# EAGLE design GEP Main Board V1.0 (EAGLE 9.5.1)
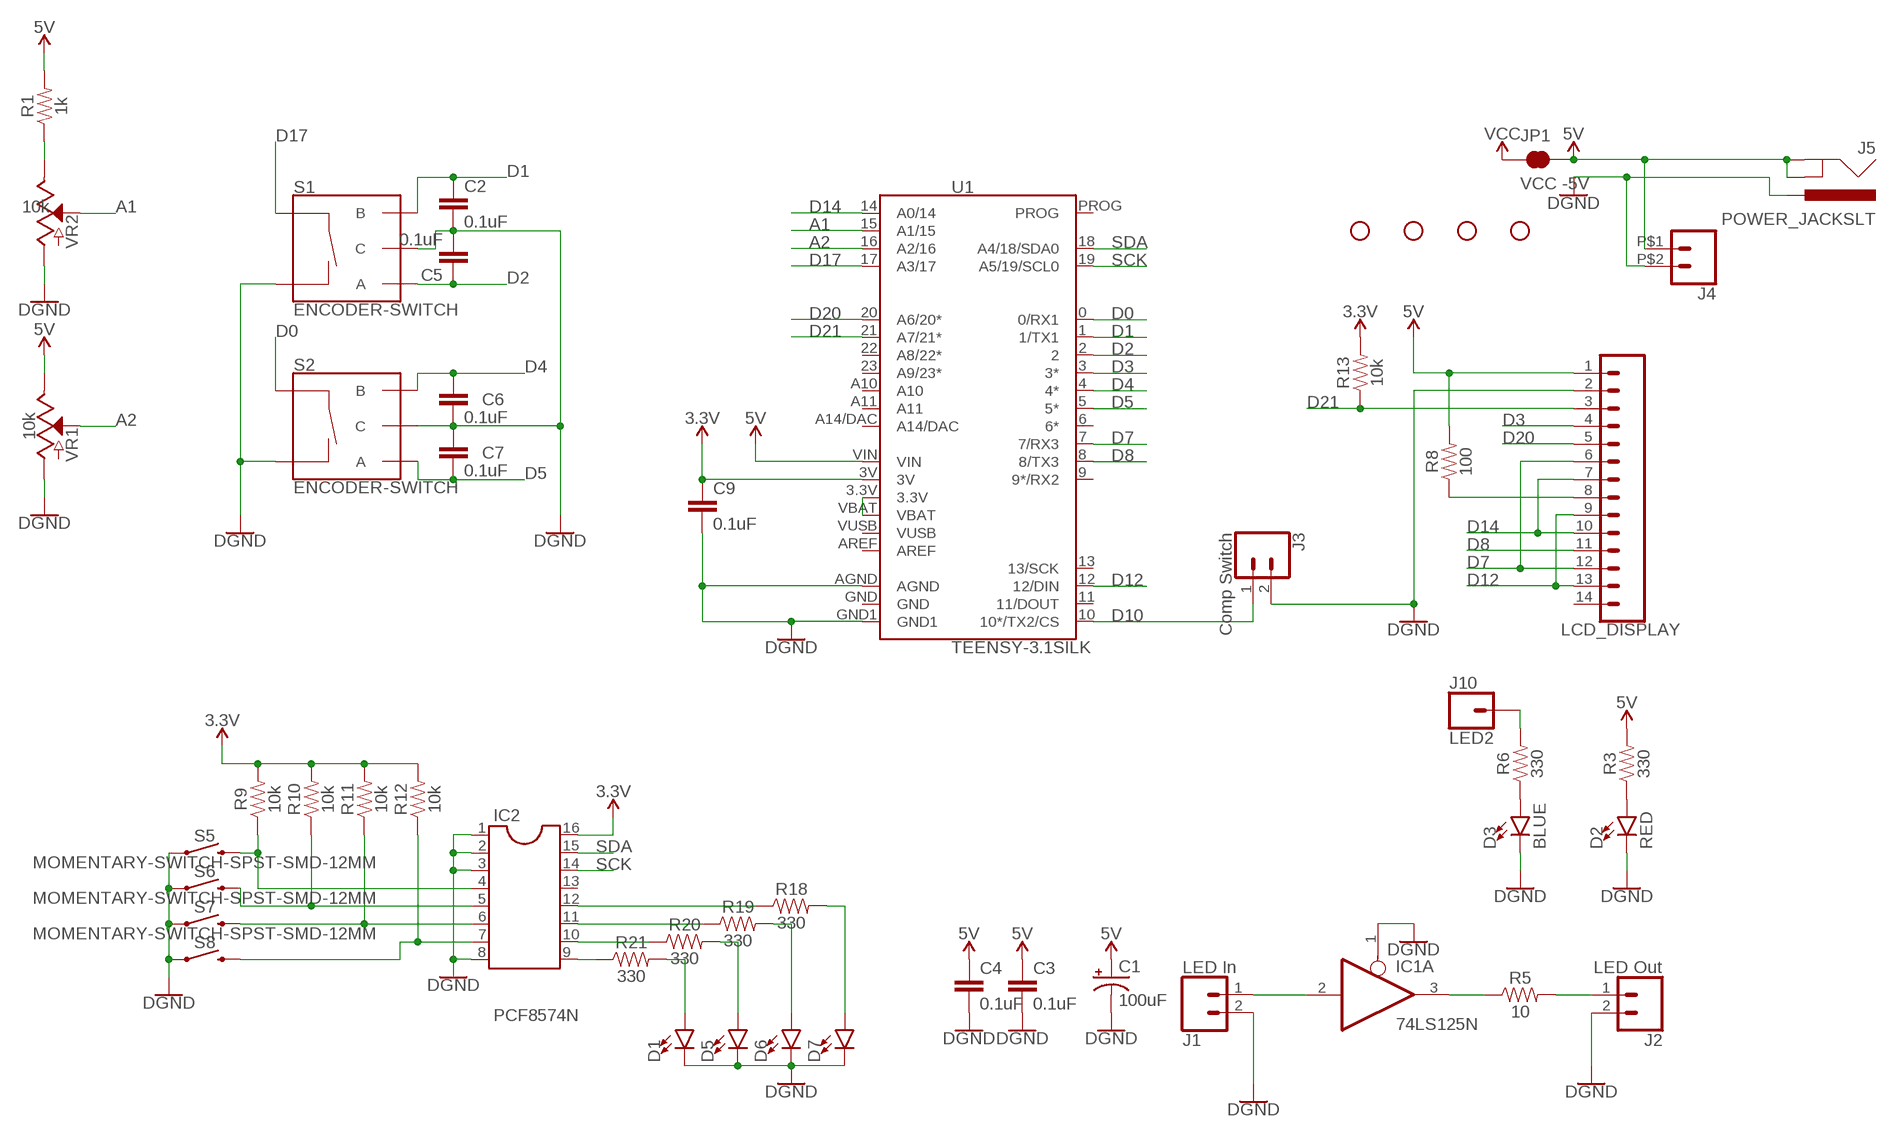
[diagram p0: schematic, sheet 1]

## Parts
C1  100uF  100UF-POLAR-RADIAL-2.5MM-25V-20%  [CPOL-RADIAL-2.5MM-6.5MM]
C2  0.1uF  0.1UF-KIT-EZ-50V-20%  [CAP-PTH-SMALL-KIT]
C3  0.1uF  0.1UF-KIT-EZ-50V-20%  [CAP-PTH-SMALL-KIT]
C4  0.1uF  0.1UF-KIT-EZ-50V-20%  [CAP-PTH-SMALL-KIT]
C5  0.1uF  0.1UF-KIT-EZ-50V-20%  [CAP-PTH-SMALL-KIT]
C6  0.1uF  0.1UF-KIT-EZ-50V-20%  [CAP-PTH-SMALL-KIT]
C7  0.1uF  0.1UF-KIT-EZ-50V-20%  [CAP-PTH-SMALL-KIT]
C9  0.1uF  0.1UF-KIT-EZ-50V-20%  [CAP-PTH-SMALL-KIT]
D1  LED5MM  [LED_5MM]
D2  RED  LED5MM  [LED_5MM]
D3  BLUE  LED5MM  [LED_5MM]
D5  LED5MM  [LED_5MM]
D6  LED5MM  [LED_5MM]
D7  LED5MM  [LED_5MM]
H1  STAND-OFF  [STAND-OFF]
H2  STAND-OFF  [STAND-OFF]
H3  STAND-OFF  [STAND-OFF]
H4  STAND-OFF  [STAND-OFF]
IC1  74LS125N  [DIL14]
IC2  PCF8574N  DIL16S  [SOCKET-16]
J1  LED In  CONN_02  [1X02]
J2  LED Out  CONN_02  [1X02]
J3  Comp Switch  CONN_02  [1X02]
J4  CONN_02PTH2  [1X02_BIG]
J5  POWER_JACKSLT  [POWER_JACK_SLOT]
J10  LED2  CONN_01  [1X01]
JP1  VCC -5V  JUMPER-SMT_2_NC_TRACE_SILK  [SMT-JUMPER_2_NC_TRACE_SILK]
LCDDISPLAY  LCD_DISPLAY  CONN_14  [1X14]
R1  1k  1KOHM-HORIZ-1/4W-1%  [AXIAL-0.3]
R3  330  330OHM-HORIZ-1/10W-5%  [AXIAL-0.3]
R5  10  10OHM-HORIZ-1/4W-1%  [AXIAL-0.3]
R6  330  330OHM-HORIZ-1/10W-5%  [AXIAL-0.3]
R8  100  10OHM-HORIZ-1/4W-1%  [AXIAL-0.3]
R9  10k  10KOHM-HORIZ-1/4W-5%  [AXIAL-0.3]
R10  10k  10KOHM-HORIZ-1/4W-5%  [AXIAL-0.3]
R11  10k  10KOHM-HORIZ-1/4W-5%  [AXIAL-0.3]
R12  10k  10KOHM-HORIZ-1/4W-5%  [AXIAL-0.3]
R13  10k  10KOHM-HORIZ-1/4W-1%  [AXIAL-0.3]
R18  330  330OHM-HORIZ-1/10W-5%  [AXIAL-0.3]
R19  330  330OHM-HORIZ-1/10W-5%  [AXIAL-0.3]
R20  330  330OHM-HORIZ-1/10W-5%  [AXIAL-0.3]
R21  330  330OHM-HORIZ-1/10W-5%  [AXIAL-0.3]
S1  ENCODER-SWITCH  [ROTARY_ENC_PLAIN]
S2  ENCODER-SWITCH  [ROTARY_ENC_PLAIN]
S5  MOMENTARY-SWITCH-SPST-SMD-12MM  [TACTILE_SWITCH_SMD_12MM]
S6  MOMENTARY-SWITCH-SPST-SMD-12MM  [TACTILE_SWITCH_SMD_12MM]
S7  MOMENTARY-SWITCH-SPST-SMD-12MM  [TACTILE_SWITCH_SMD_12MM]
S8  MOMENTARY-SWITCH-SPST-SMD-12MM  [TACTILE_SWITCH_SMD_12MM]
U1  TEENSY-3.1SILK  [TEENSY-3.1]
VR1  10k  POTENTIOMETER-PTH-9MM-1/20W-20%-KIT  [POT-PTH-ALPS-KIT]
VR2  10k  POTENTIOMETER-PTH-9MM-1/20W-20%-KIT  [POT-PTH-ALPS-KIT]

## Nets
3.3V: C9.1 IC2.16 R9.P$2 R10.P$2 R11.P$2 R12.P$2 R13.P$2 U1.3V
5V: C1.1(+) C3.1 C4.1 J4.P$1 J5.GND@1(GNDBREAK) J5.GND@2(GND) JP1.2 LCDDISPLAY.1 R1.P$2 R3.P$2 R8.P$2 U1.VIN VR1.P$1(E)
A1: U1.15(A1/15) VR2.P$2(S)
A2: U1.16(A2/16) VR1.P$2(S)
D0: S2.SW+ U1.0(0/RX1)
D1: C2.1 S1.B U1.1(1/TX1)
D2: C5.1 S1.A U1.2
D3: LCDDISPLAY.4 U1.3(3*)
D4: C6.1 S2.B U1.4(4*)
D5: C7.2 S2.A U1.5(5*)
D7: LCDDISPLAY.6 LCDDISPLAY.12 U1.7(7/RX3)
D8: LCDDISPLAY.11 U1.8(8/TX3)
D10: J3.1 U1.10(10*/TX2/CS)
D12: LCDDISPLAY.9 LCDDISPLAY.13 U1.12(12/DIN)
D14: LCDDISPLAY.7 LCDDISPLAY.10 U1.14(A0/14)
D17: S1.SW+ U1.17(A3/17)
D20: LCDDISPLAY.5 U1.20(A6/20*)
D21: LCDDISPLAY.3 R13.P$1 U1.21(A7/21*)
GND: C1.2(-) C2.2 C3.2 C4.2 C5.2 C6.2 C7.1 C9.2 D1.K(C) D2.K(C) D3.K(C) D5.K(C) D6.K(C) D7.K(C) IC1.1(A:OE) IC2.1 IC2.2 IC2.3 IC2.8 J1.2 J2.2 J3.2 J4.P$2 J5.PWR LCDDISPLAY.2 S1.C S1.SW- S2.C S2.SW- S5.1 S6.1 S7.1 S8.1 U1.AGND U1.GND1 VR1.P$3(A) VR2.P$3(A) ; supply symbol labelled DGND
LED: LCDDISPLAY.8 R8.P$1
N$1: U1.3.3V U1.VBAT
N$2: IC2.9 R21.P$1
N$3: IC2.10 R20.P$1
N$4: IC1.2(A:I) J1.1
N$5: IC1.3(A:O) R5.P$1
N$6: R1.P$1 VR2.P$1(E)
N$8: D3.A R6.P$1
N$9: D2.A R3.P$1
N$10: IC2.5 R10.P$1 S6.3
N$11: IC2.6 R11.P$1 S7.3
N$12: IC2.7 R12.P$1 S8.3
N$13: IC2.4 R9.P$1 S5.3
N$14: J2.1 R5.P$2
N$15: IC2.11 R19.P$1
N$16: IC2.12 R18.P$1
N$17: D1.A R21.P$2
N$18: D5.A R20.P$2
N$19: D6.A R19.P$2
N$20: D7.A R18.P$2
N$23: J10.1 R6.P$2
SCK: IC2.14 U1.19(A5/19/SCL0)
SDA: IC2.15 U1.18(A4/18/SDA0)
VCC: JP1.1
Unconnected: IC1.4(B:OE) IC1.5(B:I) IC1.6(B:O) IC1.8(C:O) IC1.9(C:I) IC1.10(C:OE) IC1.11(D:O) IC1.12(D:I) IC1.13(D:OE) IC2.13 LCDDISPLAY.14 U1.6(6*) U1.9(9*/RX2) U1.11(11/DOUT) U1.13(13/SCK) U1.22(A8/22*) U1.23(A9/23*) U1.A10 U1.A11 U1.A14/DAC U1.AREF U1.PROG

## Power pins joined to a net without a drawn wire
GND: IC1.7(P:GND) U1.GND
VCC: IC1.14(P:VCC)
VUSB: U1.VUSB

## Library data of the parts
C1 = SparkFun-Capacitors:100UF-POLAR: 100µF polarized capacitors A capacitor is a passive two-terminal electrical component used to store electrical energy temporarily in an electric field.; PROD_ID: CAP-08439
C2-C7 C9 = SparkFun-Capacitors:0.1UF: 0.1µF ceramic capacitors A capacitor is a passive two-terminal electrical component used to store electrical energy temporarily in an electric field.; PROD_ID: CAP-08370
D1-D3 D5-D7 = SparkFun-LED:LED: LED (Generic) Standard schematic elements and footprints for 5mm, 3mm, 1206, and 0603 sized LEDs. Generic LEDs with no color specified.
H1-H4 = SparkFun-Hardware:STAND-OFF: Stand Off Drill holes for mechanically mounting via screws, standoffs, etc. Note: Use the keepout ring to avoid running the screw head into surrounding components. Variant Overviews STAND-OFF - Mechanical footprint for a #4 phillips button head screw. STAND-OFF-TIGHT - Mechanical footprint for a #4 phillips button head screw, Example SparkFun Products Screw - Phillips Head (1/4", 4-40, 10 pack) <https://www.sparkfun.com/products/10453> (PRT-10453) Screw - Phillips Head (1/2", 4-40, 10 pack) <https://www.sparkfun.com/products/10452> (PRT-10452) Screw - Phillips Head (3/4", 4-40, 10 pack) <https://www.sparkfun.com/products/10451> (PRT-10451) Screw - Phillips Head (1", 4-40, 10 pack) <https://www.sparkfun.com/products/10450> (PRT-10450)
IC1 = 74xx-us:74*125: Quad bus BUFFER, 3-state
IC2 = ic-package:DIL16: Dual In Line / Socket
J1-J4 = SparkFun-Connectors:CONN_02: Multi connection point. Often used as Generic Header-pin footprint for 0.1 inch spaced/style header connections On any of the 0.1 inch spaced packages, you can populate with these: Break Away Headers - Straight <https://www.sparkfun.com/products/116> (PRT-00116) Break Away Male Headers - Right Angle <https://www.sparkfun.com/products/553> (PRT-00553) Female Headers <https://www.sparkfun.com/products/115> (PRT-00115) Break Away Headers - Machine Pin <https://www.sparkfun.com/products/117> (PRT-00117) Break Away Female Headers - Swiss Machine Pin <https://www.sparkfun.com/products/743> (PRT-00743) For SCREWTERMINALS and SPRING TERMINALS visit here: Screw Terimnals on SparkFun.com <https://www.sparkfun.com/search/results?term=Screw+Terminals> (5mm/3.5mm/2.54mm spacing) This device is also useful as a general connection point to wire up your design to another part of your project. Our various solder wires solder well into these plated through hole pads. Hook-Up Wire - Assortment (Stranded, 22 AWG) <https://www.sparkfun.com/products/11375> (PRT-11375) Hook-Up Wire - Assortment (Solid Core, 22 AWG) <https://www.sparkfun.com/products/11367> (PRT-11367) View the entire wire category on our website here <https://www.sparkfun.com/categories/141> Special notes: Molex polarized connector foot print use with: PRT-08233 with associated crimp pins and housings. 2.54_SCREWTERM for use with PRT-10571. 3.5mm Screw Terminal footprints for PRT-08084 5mm Screw Terminal footprints for use with PRT-08432
J5 = SparkFun-Connectors:POWER_JACK: Power Jack Connector This is the standard 5.5mm barrel jack for power. The PTH is the most common, proven, reliable, footprint. The Slot footprint only works if the mill layer is transmitted to the PCB fab house so be warned. Here are the connectors we sell at SparkFun: DC Barrel Power Jack/Connector <https://www.sparkfun.com/products/119> (PRT-00119) DC Barrel Power Jack/Connector (SMD) <https://www.sparkfun.com/products/12748> (PRT-12748) DC Barrel Jack Adapter - Breadboard Compatible <https://www.sparkfun.com/products/10811> (PRT-10811) It is used on this SparkFun product (and many, many others): SparkFun RedBoard - Programmed with Arduino <https://www.sparkfun.com/products/12757> (DEV-12757) Also, if you need a mating power supply or connector, please check these out: Wall Adapter Power Supply - 9VDC 650mA <https://www.sparkfun.com/products/298> (TOL-00298) DC Barrel Jack Adapter - Male <https://www.sparkfun.com/products/10287> (PRT-10287); PROD_ID: PRT-00119
J10 = SparkFun-Connectors:CONN_01: Single connection point. Often used as Generic Header-pin footprint for 0.1 inch spaced/style header connections On any of the 0.1 inch spaced packages, you can populate with these: Break Away Headers - Straight <https://www.sparkfun.com/products/116> (PRT-00116) Break Away Male Headers - Right Angle <https://www.sparkfun.com/products/553> (PRT-00553) Female Headers <https://www.sparkfun.com/products/115> (PRT-00115) Break Away Headers - Machine Pin <https://www.sparkfun.com/products/117> (PRT-00117) Break Away Female Headers - Swiss Machine Pin <https://www.sparkfun.com/products/743> (PRT-00743) This device is also useful as a general connection point to wire up your design to another part of your project. Our various solder wires solder well into these plated through hole pads. Hook-Up Wire - Assortment (Stranded, 22 AWG) <https://www.sparkfun.com/products/11375> (PRT-11375) Hook-Up Wire - Assortment (Solid Core, 22 AWG) <https://www.sparkfun.com/products/11367> (PRT-11367) View the entire wire category on our website here <https://www.sparkfun.com/categories/141> Special notes: SMTSO-256-ET is a "flush mount" nut for a 4-40 screw. We mostly use this on specialty testbeds; it is a nice way to connect hardware to your PCB at an adjustable hieght. Also note, the SNAP packages are for using a snappable style connector. We sell a baggie of snaps and they are also used on two LilyPad designs: Snap Assortment - 30 pack (male and female) <https://www.sparkfun.com/products/11347> (DEV-11347) LilyPad Arduino SimpleSnap <https://www.sparkfun.com/products/10941> (DEV-10941) LilyPad SimpleSnap Protoboard <https://www.sparkfun.com/products/10940> (DEV-10940)
JP1 = SparkFun-Jumpers:JUMPER-SMT_2_NC_TRACE: Normally closed trace jumper This jumper has a trace between two pads so it's normally closed (NC). Use a razor knife to open the connection. For best results follow the IPC guidelines for cutting traces: Cutout at least 0.063 mm (0.005 in). Remove all loose material to clean up the cut area. Seal the cut with an approved epoxy. Reapply solder to reclose the connection.
LCDDISPLAY = SparkFun-Connectors:CONN_14: Multi connection point. Often used as Generic Header-pin footprint for 0.1 inch spaced/style header connections On any of the 0.1 inch spaced packages, you can populate with these: Break Away Headers - Straight <https://www.sparkfun.com/products/116> (PRT-00116) Break Away Male Headers - Right Angle <https://www.sparkfun.com/products/553> (PRT-00553) Female Headers <https://www.sparkfun.com/products/115> (PRT-00115) Break Away Headers - Machine Pin <https://www.sparkfun.com/products/117> (PRT-00117) Break Away Female Headers - Swiss Machine Pin <https://www.sparkfun.com/products/743> (PRT-00743) For SCREWTERMINALS and SPRING TERMINALS visit here: Screw Terimnals on SparkFun.com <https://www.sparkfun.com/search/results?term=Screw+Terminals> (5mm/3.5mm/2.54mm spacing) This device is also useful as a general connection point to wire up your design to another part of your project. Our various solder wires solder well into these plated through hole pads. Hook-Up Wire - Assortment (Stranded, 22 AWG) <https://www.sparkfun.com/products/11375> (PRT-11375) Hook-Up Wire - Assortment (Solid Core, 22 AWG) <https://www.sparkfun.com/products/11367> (PRT-11367) View the entire wire category on our website here <https://www.sparkfun.com/categories/141> Special notes: Molex polarized connector foot print use with SKU : PRT-08231 with associated crimp pins and housings. 1MM SMD Version SKU: PRT-10208 NOTES ON THE VARIANTS LOCK and LOCK_LONGPADS... This footprint was designed to help hold the alignment of a through-hole component (i.e. 6-pin header) while soldering it into place. You may notice that each hole has been shifted either up or down by 0.005 of an inch from it's more standard position (which is a perfectly straight line). This slight alteration caused the pins (the squares in the middle) to touch the edges of the holes. Because they are alternating, it causes a "brace" to hold the component in place. 0.005 has proven to be the perfect amount of "off-center" position when using our standard breakaway headers. Although looks a little odd when you look at the bare footprint, once you have a header in there, the alteration is very hard to notice. Also,if you push a header all the way into place, it is covered up entirely on the bottom side.
R1 = SparkFun-Resistors:1KOHM: 1kΩ resistor A resistor is a passive two-terminal electrical component that implements electrical resistance as a circuit element. Resistors act to reduce current flow, and, at the same time, act to lower voltage levels within circuits. - Wikipedia; PROD_ID: RES-12182
R3 R6 R18-R21 = SparkFun-Resistors:330OHM: 330Ω resistor A resistor is a passive two-terminal electrical component that implements electrical resistance as a circuit element. Resistors act to reduce current flow, and, at the same time, act to lower voltage levels within circuits. - Wikipedia; PROD_ID: RES-8371
R5 = SparkFun-Resistors:10OHM: 10Ω resistor A resistor is a passive two-terminal electrical component that implements electrical resistance as a circuit element. Resistors act to reduce current flow, and, at the same time, act to lower voltage levels within circuits. - Wikipedia; PROD_ID: RES-12180
R8 = SparkFun-Resistors:10OHM: 10Ω resistor A resistor is a passive two-terminal electrical component that implements electrical resistance as a circuit element. Resistors act to reduce current flow, and, at the same time, act to lower voltage levels within circuits. - Wikipedia; PROD_ID: RES-12180; VALUE: 10
R9-R12 = SparkFun-Resistors:10KOHM: 10kΩ resistor A resistor is a passive two-terminal electrical component that implements electrical resistance as a circuit element. Resistors act to reduce current flow, and, at the same time, act to lower voltage levels within circuits. - Wikipedia; PROD_ID: RES-09435
R13 = SparkFun-Resistors:10KOHM: 10kΩ resistor A resistor is a passive two-terminal electrical component that implements electrical resistance as a circuit element. Resistors act to reduce current flow, and, at the same time, act to lower voltage levels within circuits. - Wikipedia; PROD_ID: RES-12183
S1 S2 = SparkFun-Switches:ENCODER-SWITCH: Rotary Encoder w/ Select Switch Encoders rotate similarly to potentiometers, but they’re different from potentiometers in that an encoder has full rotation without limits. They output gray code so that you can tell how much and in which direction the encoder has been turned. This encoder includes a push-down select switch built into the shaft. SparkFun Products Rotary Encoder <https://www.sparkfun.com/products/9117> (COM-09117); SF_SKU: COM-09117
S5-S8 = SparkFun-Switches:MOMENTARY-SWITCH-SPST: Momentary Switch (Pushbutton) - SPST Normally-open (NO) SPST momentary switches (buttons, pushbuttons). Variants PTH-12MM - 12mm square, through-hole Momentary Pushbutton Switch - 12mm Square <https://www.sparkfun.com/products/9190> (COM-09190) PTH-6.0MM, PTH-6.0MM-KIT - 6.0mm square, through-hole Mini Pushbutton Switch <https://www.sparkfun.com/products/97> (COM-00097) KIT package intended for soldering kit's - only one side of pads' copper is exposed. PTH-RIGHT-ANGLE-KIT - Right-angle, through-hole Right Angle Tactile Button <https://www.sparkfun.com/products/10791> - Used on SparkFun BigTime Watch Kit <https://www.sparkfun.com/products/11734> SMD-12MM - 12mm square, surface-mount Tactile Button - SMD (12mm) <https://www.sparkfun.com/products/12993> (COM-12993) Used on SparkFun PicoBoard <https://www.sparkfun.com/products/11888> SMD-4.5MM - 4.5mm Square Trackball Switch Used on SparkFun Blackberry Trackballer Breakout <https://www.sparkfun.com/products/13169> SMD-4.6MMX2.8MM - 4.60mm x 2.80mm, surface mount Used on SparkFun SAMD21 Mini Breakout <https://www.sparkfun.com/products/13664> SMD-5.2MM, SMD-5.2-REDUNDANT - 5.2mm square, surface-mount Mini Pushbutton Switch - SMD <https://www.sparkfun.com/products/8720> (COM-08720) Used on Arduino Pro Mini <https://www.sparkfun.com/products/11114> REDUNDANT package connects both switch circuits together SMD-6.0X3.5MM - 6.0 x 3.5mm, surface mount Momentary Reset Switch SMD <https://www.sparkfun.com/products/8229> (COM-08229) SMD-6.2MM-TALL - 6.2mm square, surface mount Tactile Button - SMD (6mm) <https://www.sparkfun.com/products/12992> Used on SparkFun Digital Sandbox <https://www.sparkfun.com/products/12651> SMD-RIGHT-ANGLE - Right-angle, surface mount Used on SparkFun Block for Intel® Edison - Arduino <https://www.sparkfun.com/products/13036>; PROD_ID: SWCH-11967; SF_SKU: COM-12993
U1 = SparkFun-Boards:TEENSY-3.1: Teensy 3+ Footprint Mechanical footprint with connectors for Teensy Development Board with ARM Cortex. SparkFun Products: Teensy 3.2 <https://www.sparkfun.com/products/13736> Teensy LC <https://www.sparkfun.com/products/13305>; SF_ID: DEV-12646
VR1 VR2 = SparkFun-Resistors:POTENTIOMETER: Potentiometer (Pot) Three-terminal potentiometers, with an adjustable wiper and two adjustable resistors. A pot can be used to create a configurable voltage divider, or as a variable resistor. Variants ALPS_POT and ALPS_POT_KIT - PTH, breadboard compatible, 9mm square pots Rotary Potentiometer - Linear (10k ohm) <https://www.sparkfun.com/products/9288> (COM-09288) The KIT variant exposes copper on only one side of the PTH pad, so the part can only be assembled on one side of the PCB. Useful for beginner soldering kits.; PROD_ID: RES-09177; SF_SKU: COM-09288

## Board
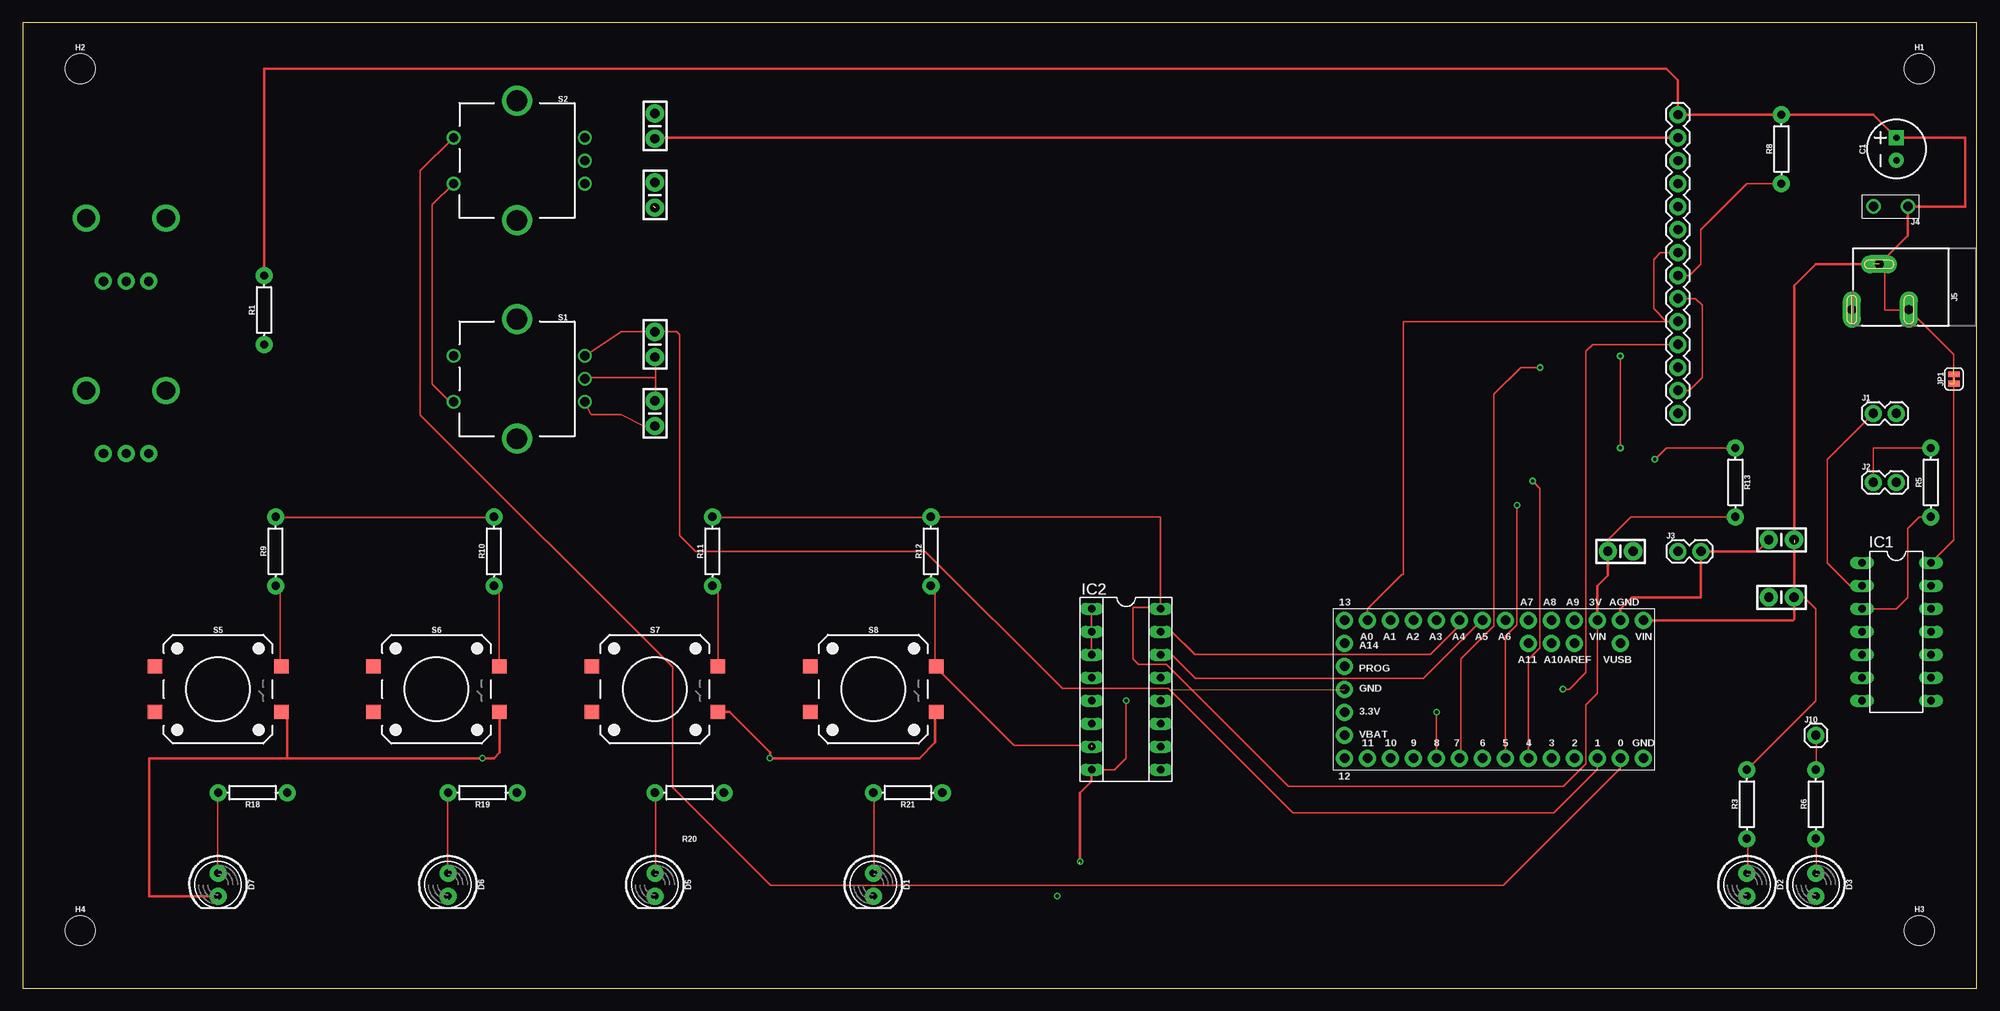
[diagram p1: board, top side]
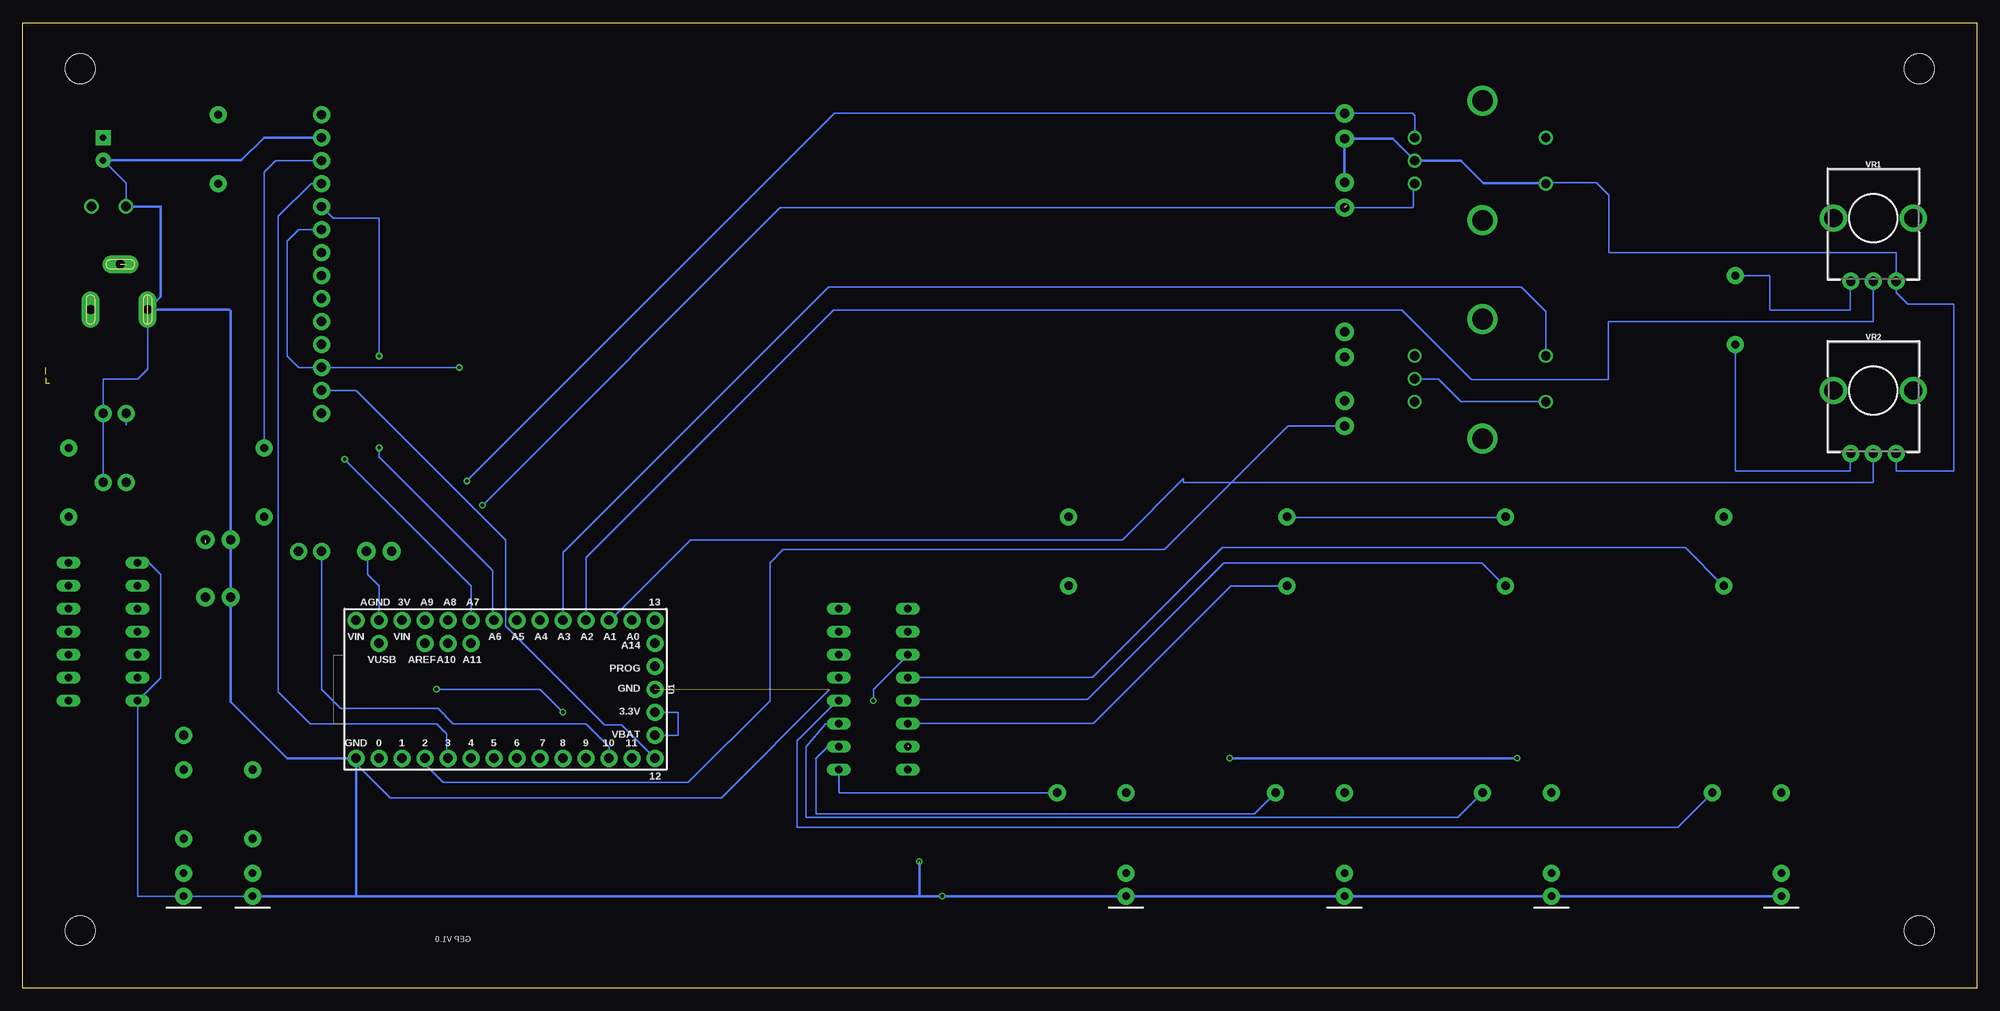
[diagram p2: board, bottom side, seen from below]

Size 215.9 x 106.68 mm. Coordinates in mm from the lower left corner, seen from the top.
Outline: 0,0 215.9,0 215.9,106.68 0,106.68 0,0
Copper layers (1*16): Top 0.035mm / dielectric 1.5mm / Bottom 0.035mm
Design rules "default *": minimum track width 6mil, minimum drill 0.35mm, track to track 10mil, track to pad 10mil, pad to pad 10mil, via to via 10mil, smd to smd 6mil, copper to edge 40mil, drill to drill 6mil, minimum pad ring 10mil, minimum via ring 8mil, stop-mask expansion 4mil, vias tented up to drill 0mil, thermal gap 10mil

### Footprints (pad centres in the part's own frame; a part is rotated, then mirrored left to right if it is on the bottom)
CPOL-RADIAL-2.5MM-6.5MM = drill 0.7 pad 1.651 square: 1 1.25,0 | drill 0.7 pad 1.651: 2 -1.25,0
CAP-PTH-SMALL-KIT = drill 1.016 pad 2.032: 1 -1.397,0; 2 1.397,0
LED_5MM = drill 0.813 pad 1.88: A -1.27,0; K 1.27,0
STAND-OFF = hole 3.302: 0,0
DIL14 = drill 0.813 long: 1 -7.62,-3.81; 2 -5.08,-3.81; 3 -2.54,-3.81; 4 0,-3.81; 5 2.54,-3.81; 6 5.08,-3.81; 7 7.62,-3.81; 8 7.62,3.81; 9 5.08,3.81; 10 2.54,3.81; 11 0,3.81; 12 -2.54,3.81; 13 -5.08,3.81; 14 -7.62,3.81
SOCKET-16 = drill 0.813 long: 1 -8.89,-3.81; 2 -6.35,-3.81; 3 -3.81,-3.81; 4 -1.27,-3.81; 5 1.27,-3.81; 6 3.81,-3.81; 7 6.35,-3.81; 8 8.89,-3.81; 9 8.89,3.81; 10 6.35,3.81; 11 3.81,3.81; 12 1.27,3.81; 13 -1.27,3.81; 14 -3.81,3.81; 15 -6.35,3.81; 16 -8.89,3.81
1X02 = drill 1.016 pad 1.88: 1 0,0; 2 2.54,0
1X02_BIG = drill 1.067: P$1 0,0; P$2 3.81,0
POWER_JACK_SLOT = drill 1 pad 2 long: GND@1 2.58,7.5; GND@2 7.58,10.8; PWR 2.58,13.8
1X01 = drill 1.016 pad 1.88: 1 0,0
SMT-JUMPER_2_NC_TRACE_SILK = smd 0.635 x 1.27: 1 -0.508,0; 2 0.508,0
1X14 = drill 1.016 pad 1.88: 1 0,0; 2 2.54,0; 3 5.08,0; 4 7.62,0; 5 10.16,0; 6 12.7,0; 7 15.24,0; 8 17.78,0; 9 20.32,0; 10 22.86,0; 11 25.4,0; 12 27.94,0; 13 30.48,0; 14 33.02,0
AXIAL-0.3 = drill 0.9 pad 1.88: P$1 -3.81,0; P$2 3.81,0
ROTARY_ENC_PLAIN = drill 1.016: A 7.493,-2.54; B 7.493,2.54; C 7.493,0; SW+ -6.985,2.54; SW- -6.985,-2.54 | drill 2.286: P$3 0,6.604; P$4 0,-6.604
TACTILE_SWITCH_SMD_12MM = smd 1.6 x 1.55: 1 6.975,-2.5; 2 -6.975,-2.5; 3 6.975,2.5; 4 -6.975,2.5
TEENSY-3.1 = drill 1.016 pad 1.88: 0 7.62,-13.97; 1 7.62,-11.43; 2 7.62,-8.89; 3 7.62,-6.35; 3.3V 2.54,16.51; 3V -7.62,-11.43; 4 7.62,-3.81; 5 7.62,-1.27; 6 7.62,1.27; 7 7.62,3.81; 8 7.62,6.35; 9 7.62,8.89; 10 7.62,11.43; 11 7.62,13.97; 12 7.62,16.51; 13 -7.62,16.51; 14 -7.62,13.97; 15 -7.62,11.43; 16 -7.62,8.89; 17 -7.62,6.35; 18 -7.62,3.81; 19 -7.62,1.27; 20 -7.62,-1.27; 21 -7.62,-3.81; 22 -7.62,-6.35; 23 -7.62,-8.89; A10 -5.08,-6.35; A11 -5.08,-3.81; A14/DAC -5.08,16.51; AGND -7.62,-13.97; AREF -5.08,-8.89; GND 0,16.51; GND1 7.62,-16.51; PROG -2.54,16.51; VBAT 5.08,16.51; VIN -7.62,-16.51; VUSB -5.08,-13.97
POT-PTH-ALPS-KIT = drill 1 pad 1.88: P$1 7,-2.5; P$2 7,0; P$3 7,2.5 | drill 2: P$4 0,-4.4; P$5 0,4.4

### Placement (x,y rotation side)
C1  207.01,92.71 90 top
C2  69.85,71.12 270 top
C3  194.31,49.53 180 top
C4  194.31,43.18 180 top
C5  69.85,63.5 90 top
C6  69.85,95.25 270 top
C7  69.85,87.63 270 top
C9  176.53,48.26 0 top
D1  93.98,11.43 270 top
D2  190.5,11.43 270 top
D3  198.12,11.43 270 top
D5  69.85,11.43 270 top
D6  46.99,11.43 270 top
D7  21.59,11.43 270 top
H1  209.55,101.6 0 top
H2  6.35,101.6 0 top
H3  209.55,6.35 0 top
H4  6.35,6.35 0 top
IC1  207.01,39.37 270 top
IC2  121.92,33.02 270 top
J1  204.47,63.5 0 top
J2  204.47,55.88 0 top
J3  182.88,48.26 0 top
J4  208.28,86.36 180 top
J5  215.9,72.39 90 top
J10  198.12,27.94 0 top
JP1  213.36,67.31 90 top
LCDDISPLAY  182.88,96.52 270 top
R1  26.67,74.93 90 top
R3  190.5,20.32 90 top
R5  210.82,55.88 90 top
R6  198.12,20.32 90 top
R8  194.31,92.71 90 top
R9  27.94,48.26 90 top
R10  52.07,48.26 90 top
R11  76.2,48.26 90 top
R12  100.33,48.26 90 top
R13  189.23,55.88 270 top
R18  25.4,21.59 180 top
R19  50.8,21.59 180 top
R20  73.66,21.59 180 top
R21  97.79,21.59 180 top
S1  54.61,67.31 0 top
S2  54.61,91.44 0 top
S5  21.59,33.02 0 top
S6  45.72,33.02 0 top
S7  69.85,33.02 0 top
S8  93.98,33.02 0 top
U1  162.56,33.02 270 bottom
VR1  11.43,85.09 270 bottom
VR2  11.43,66.04 270 bottom

### Tracks (layer width: path | path; a pad name or v marks a point on that pad's centre or on a via)
3.3V
  Top 0.152: R9.P$2 28.04,52.02 52.02,52.02 R10.P$2 | R11.P$2 76.2,52.02 100.18,52.02 R12.P$2 125.73,52.07 IC2.16 125.58,42.06 122.68,42.06 122.68,36.37 123.29,35.76 126.39,35.76 139.85,22.3 170.23,22.3 172.72,24.79 172.72,31.29 173.99,32.56 U1.3V | C9.1 175.13,49.53 177.67,52.07 R13.P$2
  Top 0.254: C9.1 175.13,45.59 173.99,44.45 U1.3V
  Bottom 0.152: R10.P$2 52.22,52.02 76.2,52.02 R11.P$2
5V  (3 unrouted)
  Top 0.152: 195.68,43.08 C4.1 196.85,43.18 198.12,41.91 198.12,31.75 R3.P$2 | 26.56,78.84 R1.P$2 | C1.1 206.86,94.08 | R8.P$2 194.46,96.52 | 205.44,80.31 J5.GND@2 205.74,79.33 205.74,74.93 208.36,74.93 J5.GND@1 213.36,70.01 213.36,68.58
  Top 0.254: C1.1 204.45,96.52 194.46,96.52 | R8.P$2 LCDDISPLAY.1 182.88,100.33 181.61,101.6 26.67,101.6 R1.P$2 | C1.1 207.03,93.98 214.63,93.98 214.63,86.36 J4.P$1 208.28,83.15 J5.GND@2 | C3.1 195.71,77.6 198.12,80.01 204.47,80.01 | U1.VIN 195.58,40.64 195.71,40.77 C4.1 195.71,49.2
  Bottom 0.152: VR1.P$1 13.97,78.05 13.97,74.93 22.86,74.93 22.86,78.74 R1.P$2
A1
  Bottom 0.152: U1.15 150.98,40.64 142.09,49.53 94.39,49.53 87.63,56.29 87.63,55.88 11.43,55.88 VR2.P$2
A2
  Bottom 0.152: U1.16 153.67,47.6 126.34,74.93 63.5,74.93 55.83,67.26 40.69,67.26 40.69,73.61 40.64,73.66 11.43,73.66 VR1.P$2
D0
  Top 0.152: S2.SW+ 43.94,90.3 43.94,63.33 71.78,35.49 71.78,22.2 82.65,11.33 163.58,11.33 176.53,24.28 U1.0
D1
  Top 0.152: S1.B 65.99,72.44 66.06,72.52 C2.1 72.26,72.52 72.59,72.19 72.59,49.99 74.32,48.26 99.72,48.26 114.86,33.12 126.59,33.12 140.36,19.36 169.16,19.36 173.99,24.18 U1.1
D2
  Top 0.152: S1.A 62.81,63.35 66.09,63.35 68.58,62.1 C5.1
  Bottom 0.152: C5.1 76.12,62.1 89.76,48.46 131.88,48.46 133.35,46.99 133.35,31.75 142.39,22.71 169.47,22.71 171.45,24.69 U1.2
D3
  Bottom 0.152: U1.3 169.06,25.4 169.06,28.09 170.18,29.21 184.15,29.21 187.66,32.72 187.66,85.29 184.05,88.9 LCDDISPLAY.4
D4  (via drill 0.35)
  Top 0.152: 166.42,25.4 U1.4 166.37,36.3 167.64,37.57 167.64,55.22 v166.83,56.03 | C6.1 69.72,96.52
  Bottom 0.152: 62.23,94.11 S2.B 62.1,96.39 62.36,96.65 C6.1 126.21,96.65 v166.83,56.03
D5  (1 unrouted)
  Top 0.152: U1.5 163.83,38.84 165.1,40.11 165.1,53.34
  Bottom 0.152: 69.53,86.36 69.63,86.46 | S2.A 62.23,88.77 62.23,86.36 62.36,86.23 C7.2 132.21,86.23 165.1,53.34
D7  (via drill 0.35)
  Top 0.152: U1.7 158.9,25.4 158.9,36.37 162.56,40.03 162.56,65.63 165.51,68.58 v167.64,68.58
  Bottom 0.152: LCDDISPLAY.6 185.42,83.82 186.69,82.55 186.69,69.85 185.42,68.58 LCDDISPLAY.12 v167.64,68.58
D8  (via drill 0.35)
  Top 0.152: v170.18,33.02 170.89,33.02 172.72,34.85 172.72,70.36 173.48,71.12 LCDDISPLAY.11 | U1.8 v156.21,30.48
  Bottom 0.152: v170.18,33.02 158.75,33.02 v156.21,30.48
D10
  Bottom 0.152: J3.1 182.88,33.02 180.75,30.89 170.01,30.89 168.34,29.21 153.67,29.21 151.13,26.67 U1.10
D12
  Top 0.152: LCDDISPLAY.9 184.81,76.2 185.57,75.44 185.57,67.46 184.15,66.04 LCDDISPLAY.13
  Bottom 0.152: U1.12 149.71,29.06 151.59,29.06 162.56,40.03 162.56,49.53 170.81,57.78 170.94,57.91 179.07,66.04 LCDDISPLAY.13
D14
  Top 0.152: U1.14 148.59,41.91 152.4,45.72 152.55,45.72 152.55,73.66 181.61,73.66 | LCDDISPLAY.7 180.95,81.28 180.19,80.52 180.19,75.08 181.61,73.66 | 181.61,73.66 LCDDISPLAY.10
D17
  Bottom 0.152: S1.SW+ 47.62,74.75 50.34,77.47 126.85,77.47 156.06,48.26 156.21,48.26 U1.17
D20  (via drill 0.35)
  Top 0.152: v176.53,69.85 v176.53,59.69
  Bottom 0.152: U1.20 163.98,40.64 163.98,46.13 176.53,58.67 v176.53,59.69 | LCDDISPLAY.5 181.61,85.09 176.53,85.09 v176.53,69.85
D21  (via drill 0.35)
  Top 0.152: R13.P$1 181.61,59.69 v180.34,58.42
  Bottom 0.152: LCDDISPLAY.3 187.96,91.44 189.23,90.17 R13.P$1 | v180.34,58.42 166.37,44.45 U1.21
GND  (via drill 0.35)  (2 unrouted)
  Top 0.152: 198.17,10.11 D3.K | 190.4,10.11 D2.K | 69.9,67.46 69.9,69.7 C2.2 | 69.9,67.46 69.9,65.02 C5.2 | 69.9,67.46 62.18,67.46 S1.C 61.98,67.26 61.98,67.51 | S2.SW- 45.26,86.54 45.26,66.75 47.24,64.77 S1.SW- | 21.74,10.21 D7.K | 100.79,30.68 S8.1 | 52.63,30.48 S6.1 | 47.14,10.26 D6.K 46.94,10.26 | 69.7,10.21 D5.K | 76.81,30.48 S7.1 76.81,30.68 | v121.92,31.75 121.92,25.4 120.65,24.13 IC2.8 | IC2.1 IC2.2 IC2.3
  Top 0.254: S5.1 29.21,29.88 29.21,25.4 | 29.21,25.4 v50.8,25.4 52.07,25.4 52.7,26.02 S6.1 | S7.1 78.09,30.52 82.55,26.07 v82.55,25.4 99.06,25.4 100.79,27.13 100.79,30.68 | D7.K 13.97,10.16 13.97,25.4 29.21,25.4 | IC2.8 118.11,22.86 116.84,21.59 116.84,13.77 | LCDDISPLAY.2 69.98,93.98 C6.2 | U1.AGND 176.53,41.91 177.8,43.18 185.42,43.18 J3.2 191.64,48.26 C3.2
  Bottom 0.152: 193.04,42.06 193.04,43.08 C4.2 | IC1.7 203.2,31.9 | 179.22,25.4 U1.GND1 179.07,24.79 175.31,21.03 138.68,21.03 126.8,32.92 | 190.4,10.92 190.4,10.31 D2.K D3.K 203.2,10.16 IC1.7 | 206.86,91.44 C1.2 | 182.88,93.88 LCDDISPLAY.2 | 206.86,91.64 C1.2 | 203.2,46.94 IC1.1 201.93,46.99 200.66,45.72 200.66,34.29 IC1.7 | 48.26,64.82 57,64.82 59.49,67.31 S1.C | 48.26,64.82 47.75,64.82 S1.SW- | 47.75,89 48.26,89 48.21,88.95 48.12,88.86 | 47.75,89 S2.SW- | 61.98,91.44 S2.C | 118.26,36.78 IC2.3 121.92,33.02 v121.92,31.75 | 69.9,10.21 D5.K | C1.2 204.47,88.92 J4.P$2 | 48.26,64.77 48.26,64.82 | 47.75,89 42.01,89 40.64,87.63 40.64,81.28 8.89,81.28 8.89,78.13 VR1.P$3 8.93,76.86 7.62,75.55 | 7.66,75.55 7.62,75.55 | 7.62,75.55 2.54,75.55 2.54,57.15 8.89,57.15 8.93,57.19 VR2.P$3 | J2.2 J1.2 207.01,67.31 203.2,67.31 202.1,68.41 J5.PWR | C9.2 177.8,48.13 177.8,45.72 176.53,44.45 U1.AGND
  Bottom 0.254: J5.PWR 202.06,74.93 | J5.PWR 193.08,74.97 192.91,74.8 C3.2 C4.2 192.91,31.62 186.69,25.4 U1.GND1 179.07,10.16 | J5.PWR 200.66,76.41 200.66,86.36 J4.P$2 | 182.75,93.85 LCDDISPLAY.2 189.23,93.98 191.75,91.46 C1.2 | C7.1 C6.2 64.52,93.85 S2.C 57.02,91.44 54.53,88.95 48.21,88.95 | 179.07,10.16 D2.K | 179.07,10.16 116.84,10.16 | 116.84,10.16 v114.3,10.16 D1.K D5.K D6.K D7.K | v82.55,25.4 v50.8,25.4 | 116.84,10.16 v116.84,13.97
LED
  Top 0.152: R8.P$1 190.5,88.9 185.42,83.82 185.42,80.01 184.15,78.74 LCDDISPLAY.8
N$1
  Bottom 0.152: U1.3.3V 143.51,30.48 143.51,27.94 U1.VBAT
N$2
  Bottom 0.152: R21.P$1 125.73,21.59 IC2.9
N$3
  Bottom 0.152: R20.P$1 79.81,19.25 128.27,19.25 128.27,25.4 127,26.67 IC2.10
N$4
  Top 0.152: J1.1 199.39,58.42 199.39,46.99 201.93,44.45 IC1.2
  Bottom 0.152: J1.1 204.47,62.23 | 204.47,44.45 IC1.2
N$5
  Top 0.152: IC1.3 207.01,41.91 208.28,43.18 208.28,50.8 209.55,52.07 R5.P$1
N$6
  Bottom 0.152: VR2.P$1 13.97,59 13.97,57.15 26.67,57.15 R1.P$1
N$7  (via drill 0.35)
  other vias: 165.1,53.34
N$8
  Top 0.152: D3.A 198.17,12.75 198.17,16.41 R6.P$1
N$9
  Top 0.152: D2.A 190.6,12.75 190.6,16.41 R3.P$1
N$10
  Top 0.152: R10.P$1 52.63,43.89 52.63,35.56 S6.3
  Bottom 0.152: IC2.5 118.06,31.9 98.25,31.9 83.16,46.99 54.71,46.99 52.22,44.5 R10.P$1
N$11
  Top 0.152: S7.3 76.81,35.56 76.81,43.69 76.2,44.3 R11.P$1
  Bottom 0.152: R11.P$1 82.4,44.45 97.59,29.26 118.06,29.26 IC2.6
N$12  (1 unrouted)
  Top 0.152: R12.P$1 100.38,44.3 100.79,43.89 100.79,35.56 S8.3 100.99,35.36 109.53,26.82 118.06,26.82
N$13
  Top 0.152: S5.3 28.45,35.56 28.45,43.89 28.04,44.3 R9.P$1
  Bottom 0.152: IC2.4 118.06,34.34 97.69,34.34 83.36,48.67 32.21,48.67 28.04,44.5 R9.P$1
N$14
  Top 0.152: R5.P$2 204.47,59.69 J2.1
N$15
  Bottom 0.152: IC2.11 127.2,29.21 129.34,26.67 129.34,18.85 57.35,18.85 R19.P$1
N$16
  Bottom 0.152: R18.P$1 33.02,17.78 130.35,17.78 130.35,27.33 125.93,31.75 IC2.12
N$17
  Top 0.152: D1.A 94.08,12.85 94.08,21.54 R21.P$2
N$18
  Top 0.152: D5.A 69.9,12.85 69.9,21.54 R20.P$2
N$19
  Top 0.152: D6.A 46.94,12.7 46.94,21.54 R19.P$2
N$20
  Top 0.152: D7.A 21.54,12.85 21.54,21.54 R18.P$2
N$23
  Top 0.152: R6.P$2 198.17,24.13 198.17,27.79 J10.1
SCK
  Top 0.152: IC2.14 127,36.83 129.59,34.24 154.74,34.24 161.14,40.64 U1.19
SDA
  Top 0.152: IC2.15 127,39.37 129.49,36.88 155.55,36.88 158.75,40.08 U1.18 158.7,40.64
VCC  (2 unrouted)
  Top 0.152: IC1.14 213.36,49.53 213.36,67.42 | 212.9,66.61 212.9,66.8

### Text on the board
_tNames: H2 | H1 | S2 | R8 | C1 | J4 | J5 | R1 | S1 | JP1 | J1 | J2 | R13 | R5 | J3 | IC1 | R9 | R10 | R11 | R12 | IC2 | S5 | S6 | S7 | S8 | J10 | R18 | R19 | R21 | R3 | R6 | R20 | D7 | D6 | D5 | D1 | D2 | D3 | H4 | H3
_bNames: VR1 | VR2 | U1 | GEP V1.0